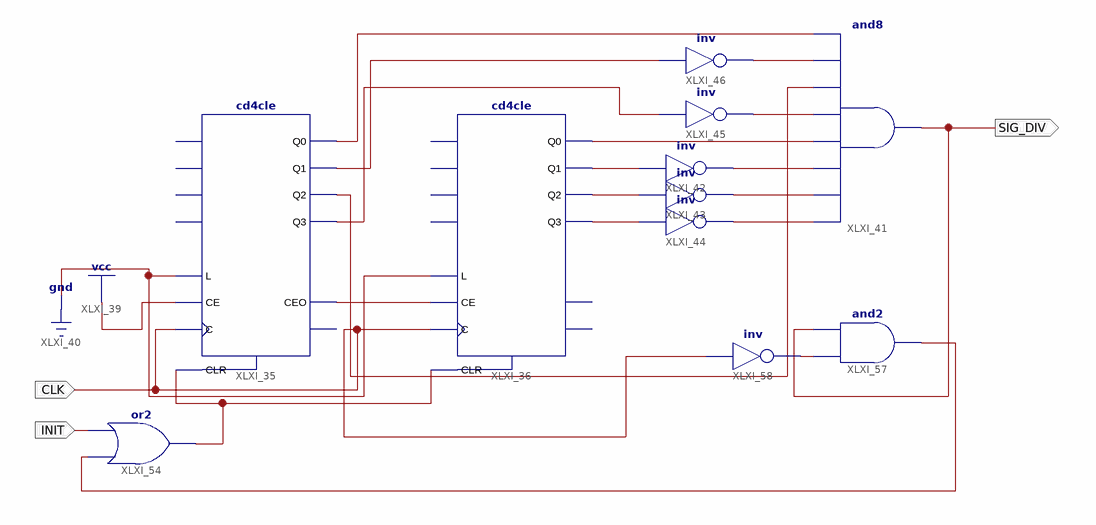
[diagram p0: schematic sheet 1]
// Xilinx ISE schematic p3ej3.sch (spartan3) as structural Verilog: 11 symbols, 3 ports
module p3ej3 (
  input  CLK,
  input  INIT,
  output SIG_DIV
);

  wire XLXN_125, XLXN_136, XLXN_137, XLXN_138, XLXN_150, XLXN_151, XLXN_174, XLXN_176, XLXN_195, XLXN_196,
       XLXN_197, XLXN_199, XLXN_200, XLXN_201, XLXN_202, XLXN_203, XLXN_205;

  cd4cle XLXI_35 (
    .C(CLK), .CE(1'b1), .CLR(XLXN_174), .L(1'b0), .CEO(XLXN_125), .Q0(XLXN_203), .Q1(XLXN_202),
    .Q2(XLXN_201), .Q3(XLXN_151));  // open: D0, D1, D2, D3, TC
  cd4cle XLXI_36 (
    .C(CLK), .CE(XLXN_125), .CLR(XLXN_174), .L(1'b0), .Q0(XLXN_199), .Q1(XLXN_136), .Q2(XLXN_137),
    .Q3(XLXN_138));  // open: D0, D1, D2, D3, CEO, TC
  and XLXI_41 (SIG_DIV, XLXN_195, XLXN_196, XLXN_197, XLXN_199, XLXN_200, XLXN_201, XLXN_150, XLXN_203);
  not XLXI_42 (XLXN_197, XLXN_136);
  not XLXI_43 (XLXN_196, XLXN_137);
  not XLXI_44 (XLXN_195, XLXN_138);
  not XLXI_45 (XLXN_200, XLXN_151);
  not XLXI_46 (XLXN_150, XLXN_202);
  or XLXI_54 (XLXN_174, XLXN_176, INIT);
  and XLXI_57 (XLXN_176, XLXN_205, SIG_DIV);
  not XLXI_58 (XLXN_205, CLK);
endmodule
